# EAGLE schematic udb-revC (EAGLE 9.6.2)
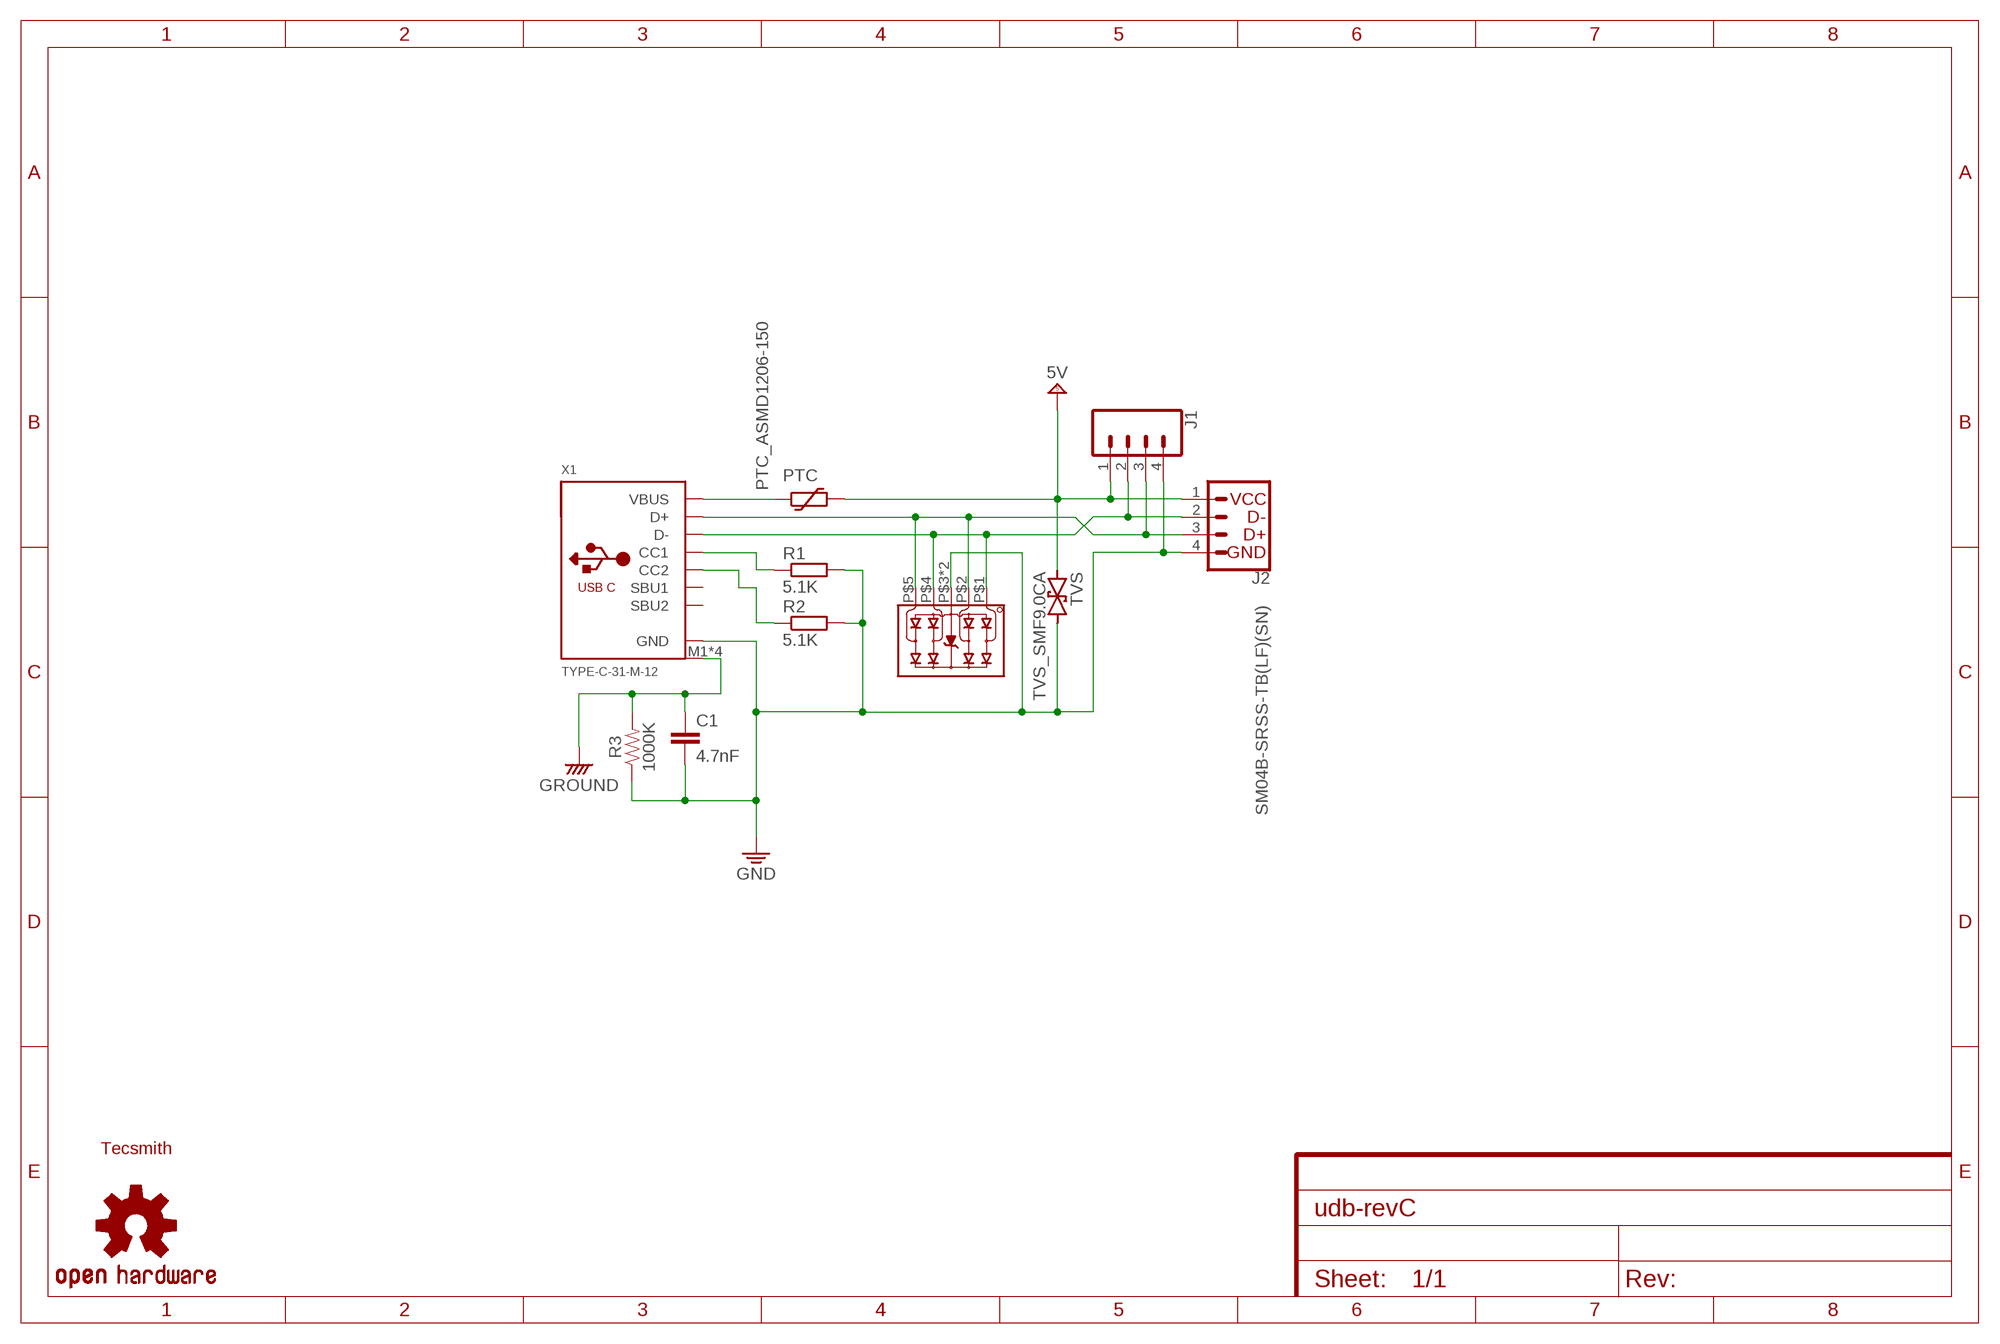
[diagram p0: schematic, sheet 1]

## Parts
C1  4.7nF  0.1UF-0603-25V-5%  [0603]
J1  CONN_04SMD_RA_FEMALE  [1X04_SMD_RA_FEMALE]
J2  SM04B-SRSS-TB(LF)(SN)  C3_UNIFIEDJS-1MM  [1X04_1MM_RA]
LOGO1  OSHW-LOGOS  [OSHW-LOGO-S]
PTC  PTC_ASMD1206-150  PTC_ASMD1206  [SMD_PTC]
R1  5.1K  R-EU_R0402  [R0402]
R2  5.1K  R-EU_R0402  [R0402]
R3  1000K  75KOHM-0603-1/10W-1%  [0603]
TVS  TVS_SMF9.0CA  [SOD123FL-BI]
U$2  TECSMITH-LOGOSHORT  [TECSMITH-CUBE]
X1  TYPE-C-31-M-12  USB_C  [TYPE-C-31-M-12]
Y1  ESD_TPD4E05U06  [DQA-10-PIN]

## Nets
CC1: R1.1 X1.A5-CC1(CC1)
CC2: R2.1 X1.B5-CC2(CC2)
D+: J1.3 J2.3(D+) X1.A6-DP1(D+) X1.B6-DP2(D+) Y1.P$2(D1-) Y1.P$5(D2-)
D-: J1.2 J2.2(D-) X1.A7-DN1(D-) X1.B7-DN2(D-) Y1.P$1(D1+) Y1.P$4(D2+)
GND: C1.2 J1.4 J2.4(GND) R1.2 R2.2 R3.1 TVS.P$2 X1.A1B12-GND(GND) X1.B1A12-GND(GND) Y1.P$3(GND) Y1.P$8(GND)
GROUND: C1.1 R3.2 X1.M1(SHIELD) X1.M2(SHIELD) X1.M3(SHIELD) X1.M4(SHIELD)
VBUS: PTC.P$1 X1.A4B9-VBUS(VBUS) X1.B4A9-VBUS(VBUS)
VSUP: J1.1 J2.1(VCC) PTC.P$2 TVS.P$1 ; supply symbol labelled 5V
Unconnected: X1.A8-SBU1(SBU1) X1.B8-SBU2(SBU2)

## Library data of the parts
C1 = SparkFun-Capacitors:0.1UF: 0.1µF ceramic capacitors A capacitor is a passive two-terminal electrical component used to store electrical energy temporarily in an electric field.; PROD_ID: CAP-08604; VALUE: 0.1uF
J1 = __untitled:CONN_04: Multi connection point. Often used as Generic Header-pin footprint for 0.1 inch spaced/style header connections On any of the 0.1 inch spaced packages, you can populate with these: Break Away Headers - Straight <https://www.sparkfun.com/products/116> (PRT-00116) Break Away Male Headers - Right Angle <https://www.sparkfun.com/products/553> (PRT-00553) Female Headers <https://www.sparkfun.com/products/115> (PRT-00115) Break Away Headers - Machine Pin <https://www.sparkfun.com/products/117> (PRT-00117) Break Away Female Headers - Swiss Machine Pin <https://www.sparkfun.com/products/743> (PRT-00743) For SCREWTERMINALS and SPRING TERMINALS visit here: Screw Terimnals on SparkFun.com <https://www.sparkfun.com/search/results?term=Screw+Terminals> (5mm/3.5mm/2.54mm spacing) This device is also useful as a general connection point to wire up your design to another part of your project. Our various solder wires solder well into these plated through hole pads. Hook-Up Wire - Assortment (Stranded, 22 AWG) <https://www.sparkfun.com/products/11375> (PRT-11375) Hook-Up Wire - Assortment (Solid Core, 22 AWG) <https://www.sparkfun.com/products/11367> (PRT-11367) View the entire wire category on our website here <https://www.sparkfun.com/categories/141> Special notes: Molex polarized connector foot print use with SKU : PRT-08231 with associated crimp pins and housings. 1MM SMD Version SKU: PRT-10208; PROD_ID: CONN-12382
J2 = __untitled:C3_UNIFIED: SparkFun I2C Standard Qwiic Connector An SMD 1mm pitch JST connector makes it easy and quick (get it? Qwiic?) to connect I2C devices to each other. The Qwiic system <http://www.sparkfun.com/qwiic> enables fast and solderless connection between popular platforms and various sensors and actuators. We carry 200mm <https://www.sparkfun.com/products/14204>, 100mm <https://www.sparkfun.com/products/14205>, 50mm <https://www.sparkfun.com/products/14206>, and breadboard friendly <https://www.sparkfun.com/products/14207> Qwiic cables. We also offer 10 pcs strips <https://www.sparkfun.com/products/14323> the SMD connectors.
LOGO1 = SparkFun-Aesthetics:OSHW-LOGO: Open-Source Hardware (OSHW) Logo This logo indicates the piece of hardware it is found on incorporates a OSHW license and/or adheres to the definition of open source hardware found here: http://freedomdefined.org/OSHW
PTC = ts_keyboards:PTC_ASMD1206
R1 R2 = rcl:R-EU_: RESISTOR, European symbol; SPICEPREFIX: R
R3 = SparkFun-Resistors:75KOHM: 75Ω resistor A resistor is a passive two-terminal electrical component that implements electrical resistance as a circuit element. Resistors act to reduce current flow, and, at the same time, act to lower voltage levels within circuits. - Wikipedia; PROD_ID: RES-09737; VALUE: 75
TVS = ts_keyboards:TVS_SMF9.0CA
U$2 = random_logos:TECSMITH-LOGO
X1 = ts_keyboards:USB_C: USB Type-C USB 2.0 Connector
Y1 = ts_keyboards:ESD_TPD4E05U06

## Net classes
0 default: width 0 mm, drill 0 mm